# EAGLE design SCHEMA (EAGLE 6.3)
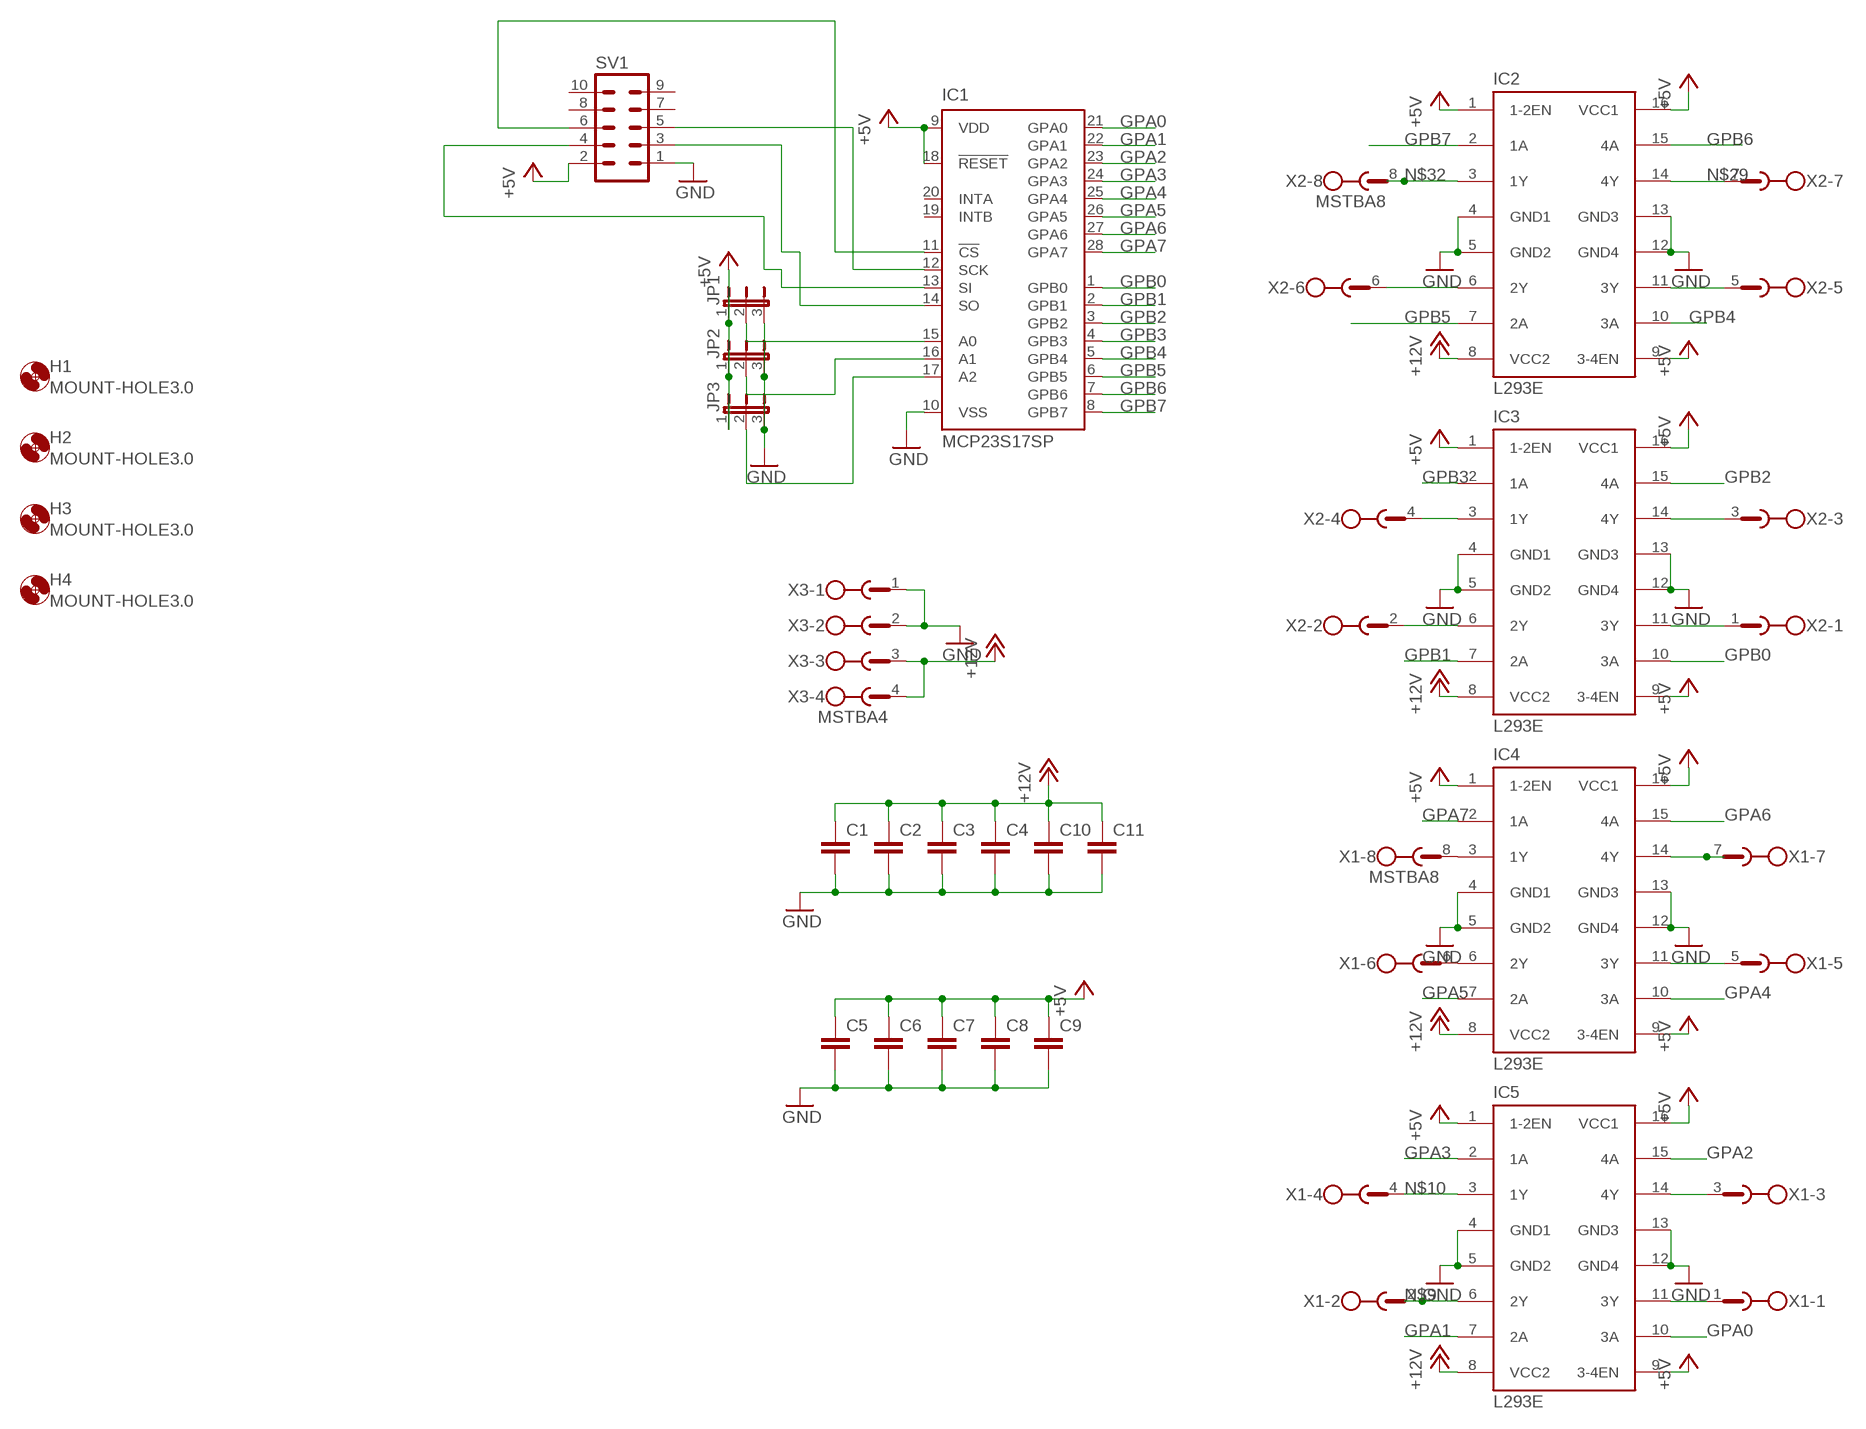
[diagram p0: schematic, sheet 1]

## Parts
C1  C-EU025-025X050  [C025-025X050]
C2  C-EU025-025X050  [C025-025X050]
C3  C-EU025-025X050  [C025-025X050]
C4  C-EU025-025X050  [C025-025X050]
C5  C-EU025-025X050  [C025-025X050]
C6  C-EU025-025X050  [C025-025X050]
C7  C-EU025-025X050  [C025-025X050]
C8  C-EU025-025X050  [C025-025X050]
C9  C-EU025-025X050  [C025-025X050]
C10  C-EU025-025X050  [C025-025X050]
C11  C-EU025-025X050  [C025-025X050]
H1  MOUNT-HOLE3.0  [3,0]
H2  MOUNT-HOLE3.0  [3,0]
H3  MOUNT-HOLE3.0  [3,0]
H4  MOUNT-HOLE3.0  [3,0]
IC1  MCP23S17SP  [DIL28-3]
IC2  L293E  [DIL16]
IC3  L293E  [DIL16]
IC4  L293E  [DIL16]
IC5  L293E  [DIL16]
JP1  JP2E  [JP2]
JP2  JP2E  [JP2]
JP3  JP2E  [JP2]
SV1  ML10  [ML10]
X1  MSTBA8  [MSTBA8]
X2  MSTBA8  [MSTBA8]
X3  MSTBA4  [MSTBA4]

## Nets
+5V: C5.1 C6.1 C7.1 C8.1 C9.1 IC1.9(VDD) IC1.18(!RESET) IC2.1(1-2EN) IC2.9(3-4EN) IC2.16(VCC1) IC3.1(1-2EN) IC3.9(3-4EN) IC3.16(VCC1) IC4.1(1-2EN) IC4.9(3-4EN) IC4.16(VCC1) IC5.1(1-2EN) IC5.9(3-4EN) IC5.16(VCC1) JP1.1 JP2.1 JP3.1 SV1.2
+12V: C1.1 C2.1 C3.1 C4.1 C10.1 C11.1 IC2.8(VCC2) IC3.8(VCC2) IC4.8(VCC2) IC5.8(VCC2) X3.3 X3.4
GND: C1.2 C2.2 C3.2 C4.2 C5.2 C6.2 C7.2 C8.2 C9.2 C10.2 C11.2 IC1.10(VSS) IC2.4(GND1) IC2.5(GND2) IC2.12(GND4) IC2.13(GND3) IC3.4(GND1) IC3.5(GND2) IC3.12(GND4) IC3.13(GND3) IC4.4(GND1) IC4.5(GND2) IC4.12(GND4) IC4.13(GND3) IC5.4(GND1) IC5.5(GND2) IC5.12(GND4) IC5.13(GND3) JP1.3 JP2.3 JP3.3 SV1.1 X3.1 X3.2
GPA0: IC1.21(GPA0) IC5.10(3A)
GPA1: IC1.22(GPA1) IC5.7(2A)
GPA2: IC1.23(GPA2) IC5.15(4A)
GPA3: IC1.24(GPA3) IC5.2(1A)
GPA4: IC1.25(GPA4) IC4.10(3A)
GPA5: IC1.26(GPA5) IC4.7(2A)
GPA6: IC1.27(GPA6) IC4.15(4A)
GPA7: IC1.28(GPA7) IC4.2(1A)
GPB0: IC1.1(GPB0) IC3.10(3A)
GPB1: IC1.2(GPB1) IC3.7(2A)
GPB2: IC1.3(GPB2) IC3.15(4A)
GPB3: IC1.4(GPB3) IC3.2(1A)
GPB4: IC1.5(GPB4) IC2.10(3A)
GPB5: IC1.6(GPB5) IC2.7(2A)
GPB6: IC1.7(GPB6) IC2.15(4A)
GPB7: IC1.8(GPB7) IC2.2(1A)
N$1: IC4.6(2Y) X1.6
N$2: IC4.3(1Y) X1.8
N$3: IC1.14(SO) SV1.3
N$4: IC1.15(A0) JP1.2
N$5: IC1.16(A1) JP2.2
N$6: IC1.17(A2) JP3.2
N$7: IC1.13(SI) SV1.4
N$8: IC1.12(SCK) SV1.5
N$9: IC5.6(2Y) X1.2
N$10: IC5.3(1Y) X1.4
N$11: IC1.11(!CS) SV1.6
N$12: IC5.14(4Y) X1.3
N$13: IC5.11(3Y) X1.1
N$16: IC4.14(4Y) X1.7
N$17: IC4.11(3Y) X1.5
N$22: IC3.14(4Y) X2.3
N$23: IC3.11(3Y) X2.1
N$26: IC3.3(1Y) X2.4
N$27: IC3.6(2Y) X2.2
N$29: IC2.14(4Y) X2.7
N$30: IC2.11(3Y) X2.5
N$31: IC2.6(2Y) X2.6
N$32: IC2.3(1Y) X2.8
Unconnected: IC1.19(INTB) IC1.20(INTA) SV1.7 SV1.8 SV1.9 SV1.10

## Library data of the parts
C1-C11 = rcl:C-EU: CAPACITOR, European symbol
H1-H4 = holes:MOUNT-HOLE: MOUNTING HOLE with drill center marker
IC1 = microchip:MCP23S17: http://ww1.microchip.com/downloads/en/DeviceDoc/21952a.pdf Source: http://ww1.microchip.com/downloads/en/DeviceDoc/21952a.pdf; MF: MICROCHIP; MPN: MCP23S17-E/SP; OC_FARNELL: 1292238; OC_NEWARK: 31K2951
IC2-IC5 = texas:L293E: TI DEVICE; MF: Arrow Electronics; MPN: L293E; OC_FARNELL: 1467711; OC_NEWARK: 89K0732
JP1-JP3 = jumper:JP2E: JUMPER
SV1 = con-harting-ml:ML10: HARTING; OC_FARNELL: unknown; OC_NEWARK: unknown
X1 X2 = con-phoenix-508:MSTBA8: PHOENIX; MF: FARNELL; MPN: 1757307; OC_FARNELL: 3705225; OC_NEWARK: 71C4166
X3 = con-phoenix-508:MSTBA4: PHOENIX; MF: FARNELL; MPN: 1757268; OC_FARNELL: 3705195; OC_NEWARK: 71C4163

## Board
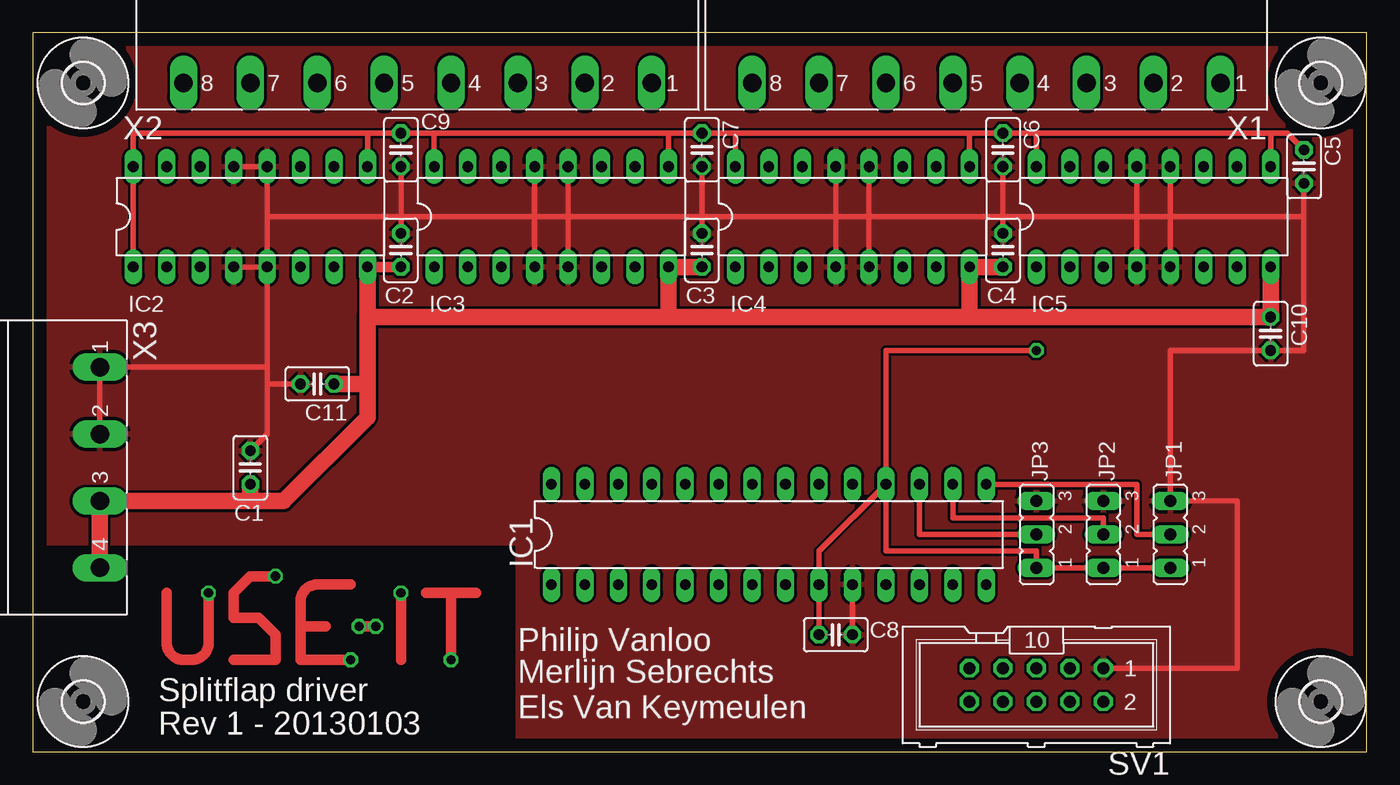
[diagram p1: board, top side]
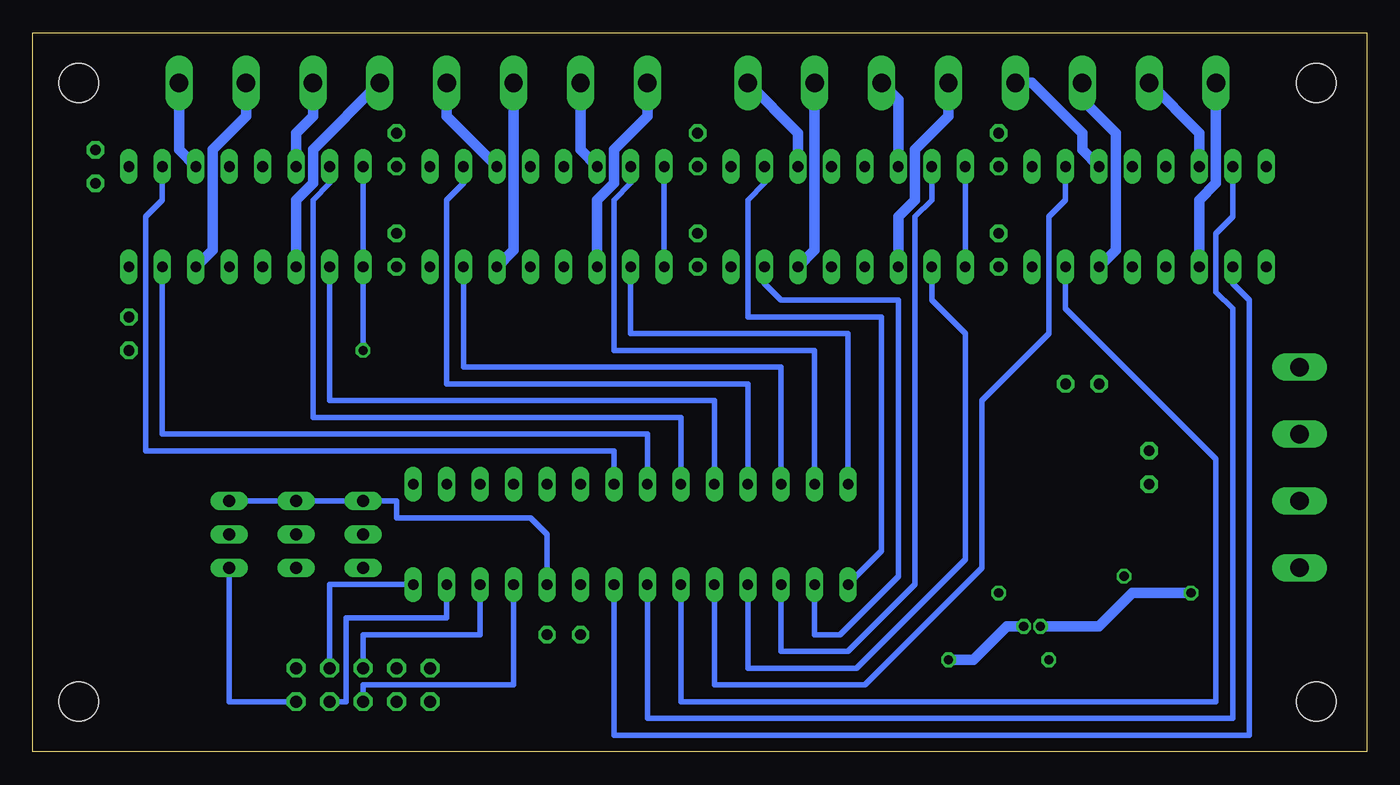
[diagram p2: board, bottom side, seen from below]

Size 101.27 x 54.6 mm. Coordinates in mm from the lower left corner, seen from the top.
Outline: 0,0 101.27,0 101.27,54.6 0,54.6 0,0
Copper layers (1*16): Top 0.035mm / dielectric 1.5mm / Bottom 0.035mm
Design rules "default": minimum track width 10mil, minimum drill 24mil, track to track 8mil, track to pad 8mil, pad to pad 8mil, via to via 8mil, smd to smd 8mil, copper to edge 40mil, drill to drill 8mil, minimum pad ring 10mil, minimum via ring 8mil, stop-mask expansion 4mil, vias tented up to drill 0mil, thermal gap 10mil

### Footprints (pad centres in the part's own frame; a part is rotated, then mirrored left to right if it is on the bottom)
C025-025X050 = drill 0.813 octagon: 1 -1.27,0; 2 1.27,0
3,0 = hole 3: 0,0
DIL28-3 = drill 0.813 long: 1 -16.51,-3.81; 2 -13.97,-3.81; 3 -11.43,-3.81; 4 -8.89,-3.81; 5 -6.35,-3.81; 6 -3.81,-3.81; 7 -1.27,-3.81; 8 1.27,-3.81; 9 3.81,-3.81; 10 6.35,-3.81; 11 8.89,-3.81; 12 11.43,-3.81; 13 13.97,-3.81; 14 16.51,-3.81; 15 16.51,3.81; 16 13.97,3.81; 17 11.43,3.81; 18 8.89,3.81; 19 6.35,3.81; 20 3.81,3.81; 21 1.27,3.81; 22 -1.27,3.81; 23 -3.81,3.81; 24 -6.35,3.81; 25 -8.89,3.81; 26 -11.43,3.81; 27 -13.97,3.81; 28 -16.51,3.81
DIL16 = drill 0.813 long: 1 -8.89,-3.81; 2 -6.35,-3.81; 3 -3.81,-3.81; 4 -1.27,-3.81; 5 1.27,-3.81; 6 3.81,-3.81; 7 6.35,-3.81; 8 8.89,-3.81; 9 8.89,3.81; 10 6.35,3.81; 11 3.81,3.81; 12 1.27,3.81; 13 -1.27,3.81; 14 -3.81,3.81; 15 -6.35,3.81; 16 -8.89,3.81
JP2 = drill 0.914 long: 1 -2.54,0; 2 0,0; 3 2.54,0
ML10 = drill 0.914 octagon: 1 -5.08,-1.27; 2 -5.08,1.27; 3 -2.54,-1.27; 4 -2.54,1.27; 5 0,-1.27; 6 0,1.27; 7 2.54,-1.27; 8 2.54,1.27; 9 5.08,-1.27; 10 5.08,1.27
MSTBA8 = drill 1.397 long: 1 -17.78,5.08; 2 -12.7,5.08; 3 -7.62,5.08; 4 -2.54,5.08; 5 2.54,5.08; 6 7.62,5.08; 7 12.7,5.08; 8 17.78,5.08
MSTBA4 = drill 1.397 long: 1 -7.62,5.08; 2 -2.54,5.08; 3 2.54,5.08; 4 7.62,5.08

### Placement (x,y rotation side)
C1  16.51,21.59 90 top
C2  27.94,38.1 90 top
C3  50.8,38.1 90 top
C4  73.66,38.1 90 top
C5  96.52,44.45 270 top
C6  73.66,45.72 270 top
C7  50.8,45.72 270 top
C8  60.96,8.89 0 top
C9  27.94,45.72 270 top
C10  93.98,31.75 270 top
C11  21.59,27.94 180 top
H1  97.79,50.8 0 top
H2  97.79,3.81 0 top
H3  3.81,3.81 0 top
H4  3.81,50.8 0 top
IC1  55.88,16.51 0 top
IC2  16.51,40.64 0 top
IC3  39.37,40.64 0 top
IC4  62.23,40.64 0 top
IC5  85.09,40.64 0 top
JP1  86.36,16.51 90 top
JP2  81.28,16.51 90 top
JP3  76.2,16.51 90 top
SV1  76.2,5.08 180 top
X1  72.39,55.88 180 top
X2  29.21,55.88 180 top
X3  0,21.59 270 top

### Tracks (layer width: path | path; a pad name or v marks a point on that pad's centre or on a via)
+5V  (via drill 0.7)
  Top 0.406: 25.4,46.99 7.62,46.99 IC2.16 IC2.1 | 25.4,46.99 C9.1 30.48,46.99 | 30.48,46.99 48.26,46.99 | 48.26,46.99 C7.1 53.34,46.99 | 53.34,46.99 71.12,46.99 | 71.12,46.99 C6.1 76.2,46.99 | 76.2,46.99 IC5.16 | IC4.16 53.34,46.99 | IC3.16 30.48,46.99 | IC2.9 25.4,46.99 | IC3.9 48.26,46.99 | IC4.9 71.12,46.99 | IC5.9 93.98,46.99 | 93.98,46.99 76.2,46.99 | v76.2,30.48 64.77,30.48 IC1.18 | IC1.18 59.69,15.24 IC1.9 C8.1 | IC1.18 64.77,15.24 76.2,15.24 JP3.1 JP2.1 JP1.1 | C5.1 95.25,46.99 93.98,46.99
  Bottom 0.406: IC3.16 IC3.1 | IC4.16 IC4.1 | IC5.16 IC5.1 v76.2,30.48 | JP1.1 86.36,3.81 SV1.2
+12V
  Top 0.406: 16.51,19.05 19.05,19.05
  Top 0.813: IC2.8 C2.1
  Top 1.27: IC2.8 25.4,33.02 | 25.4,33.02 48.26,33.02 | 48.26,33.02 71.12,33.02 | 71.12,33.02 C10.1 IC5.8 | 71.12,33.02 IC4.8 C4.1 | 48.26,33.02 IC3.8 C3.1 | X3.4 X3.3 19.05,19.05 25.4,25.4 25.4,27.94 | 25.4,27.94 25.4,33.02 | C1.1 16.51,19.05 | C11.1 25.4,27.94
GND
  Top 0.406: IC2.5 IC2.4 | IC2.13 IC2.12 17.78,40.64 | 17.78,40.64 IC2.5 | 17.78,40.64 27.94,40.64 | 27.94,40.64 38.1,40.64 | 38.1,40.64 40.64,40.64 | 40.64,40.64 50.8,40.64 | 50.8,40.64 60.96,40.64 | 60.96,40.64 63.5,40.64 | 63.5,40.64 73.66,40.64 | 73.66,40.64 83.82,40.64 | 83.82,40.64 86.36,40.64 | 86.36,40.64 IC5.12 | IC4.13 60.96,40.64 | IC4.12 63.5,40.64 | IC4.5 63.5,40.64 | IC4.4 60.96,40.64 | IC5.5 86.36,40.64 | IC5.13 83.82,40.64 | IC5.4 83.82,40.64 | IC3.4 38.1,40.64 | IC3.5 40.64,40.64 | IC3.12 40.64,40.64 | IC3.13 38.1,40.64 | 96.52,40.64 96.52,30.48 86.36,30.48 JP1.3 91.44,19.05 91.44,6.35 SV1.1 | 96.52,40.64 86.36,40.64 | X3.2 X3.1 17.78,29.21 | 17.78,27.94 17.78,29.21 | 17.78,29.21 IC2.5 | C9.2 27.94,40.64 | 27.94,40.64 C2.2 | C7.2 50.8,40.64 | 50.8,40.64 C3.2 | C6.2 73.66,40.64 | C4.2 73.66,40.64 | C5.2 96.52,40.64 | C1.2 17.78,24.13 17.78,27.94 | C8.2 IC1.10 | C11.2 17.78,27.94
  Bottom 0.406: IC1.10 62.23,16.51 63.5,17.78 73.66,17.78 73.66,19.05 JP3.3 JP2.3 JP1.3
  pour Top: -1.27,55.88 101.6,55.88 102.87,54.61 102.87,0 36.83,0 36.83,15.88 -1.27,15.88
GPA0
  Bottom 0.406: IC1.21 57.15,22.86 92.71,22.86 92.71,40.64 91.44,41.91 IC5.10
GPA1
  Bottom 0.406: IC1.22 54.61,24.13 91.44,24.13 IC5.7
GPA2
  Bottom 0.406: IC1.23 52.07,25.4 80.01,25.4 80.01,41.91 78.74,43.18 IC5.15
GPA3
  Bottom 0.406: IC1.24 49.53,26.67 78.74,26.67 IC5.2
GPA4
  Bottom 0.406: IC4.10 68.58,43.18 69.85,41.91 69.85,27.94 46.99,27.94 IC1.25
GPA5
  Bottom 0.406: IC1.26 44.45,29.21 68.58,29.21 IC4.7
GPA6
  Bottom 0.406: IC1.27 41.91,30.48 57.15,30.48 57.15,41.91 55.88,43.18 IC4.15
GPA7
  Bottom 0.406: IC1.28 39.37,31.75 55.88,31.75 IC4.2
GPB0
  Bottom 0.406: IC1.1 36.83,15.24 36.83,33.02 46.99,33.02 46.99,41.91 45.72,43.18 IC3.10
GPB1
  Bottom 0.406: IC1.2 41.91,8.89 40.01,8.89 35.56,13.34 35.56,34.29 44.45,34.29 45.72,35.56 IC3.7
GPB2
  Bottom 0.406: IC1.3 44.45,7.62 39.37,7.62 34.29,12.7 34.29,40.64 33.02,41.91 IC3.15
GPB3
  Bottom 0.406: IC1.4 46.99,6.35 38.73,6.35 30.48,14.61 30.48,31.75 33.02,34.29 IC3.2
GPB4
  Bottom 0.406: IC1.5 49.53,5.08 38.1,5.08 29.21,13.97 29.21,26.67 24.13,31.75 24.13,40.64 22.86,41.91 IC2.10
GPB5
  Bottom 0.406: IC1.6 52.07,3.81 11.43,3.81 11.43,22.23 22.86,33.66 IC2.7
GPB6
  Bottom 0.406: IC1.7 54.61,2.54 10.16,2.54 10.16,33.66 11.43,34.92 11.43,39.37 10.16,40.64 IC2.15
GPB7
  Bottom 0.406: IC1.8 57.15,1.27 8.89,1.27 8.89,34.29 10.16,35.56 IC2.2
N$1
  Bottom 0.813: IC4.6 64.77,38.1 X1.6
N$2
  Bottom 0.813: IC4.3 58.42,41.91 57.15,43.18 57.15,45.72 54.61,48.26 X1.8
N$3
  Bottom 0.406: IC1.14 78.74,12.7 SV1.3
N$4
  Top 0.406: IC1.15 83.82,20.32 83.82,16.51 JP1.2
N$5
  Top 0.406: IC1.16 69.85,17.78 81.28,17.78 JP2.2
N$6
  Top 0.406: IC1.17 67.31,16.51 JP3.2
N$7
  Bottom 0.406: IC1.13 69.85,10.16 77.47,10.16 77.47,3.81 SV1.4
N$8
  Bottom 0.406: IC1.12 67.31,8.89 76.2,8.89 SV1.5
N$9
  Bottom 0.813: IC5.6 87.63,38.1 87.63,45.72 85.09,48.26 X1.2
N$10
  Bottom 0.813: IC5.3 81.28,41.91 80.01,43.18 80.01,45.72 X1.4
N$11
  Bottom 0.406: IC1.11 64.77,5.08 76.2,5.08 SV1.6
N$12
  Bottom 0.813: IC5.14 81.28,46.99 80.01,48.26 X1.3
N$13
  Bottom 0.813: IC5.11 90.17,45.72 X1.1
N$15  (via drill 0.7)
  Top 0.813: 15.24,6.99 18.41,6.99 18.41,8.89 17.14,10.16 15.24,10.16 15.24,12.06 16.51,13.34 v18.41,13.34
N$16
  Bottom 0.813: IC4.14 59.69,45.72 X1.7
N$17
  Bottom 0.813: IC4.11 69.85,48.26 X1.5
N$18  (via drill 0.7)
  Top 0.813: 20.32,9.53 20.32,6.99 v24.13,6.99 | 20.32,9.53 20.32,11.43 arc-90 21.59,12.7 24.13,12.7 | 20.32,9.53 22.23,9.53
N$19  (via drill 0.7)
  Top 0.813: 27.94,6.99 v27.94,12.06
N$20  (via drill 0.7)
  Top 0.813: 29.84,12.06 31.75,12.06 | 33.66,12.06 31.75,12.06 | 31.75,12.06 v31.75,6.99 | v24.77,9.53 v26.04,9.53 | 10.16,12.06 10.16,8.26 arc90 11.43,6.99 12.06,6.99 arc90 13.34,8.26 v13.34,12.06
  Bottom 0.813: v31.75,6.99 29.84,6.99 27.3,9.53 v26.04,9.53 | v24.77,9.53 20.32,9.53 17.78,12.06 v13.34,12.06
N$22
  Bottom 0.813: X2.3 35.56,49.53 IC3.14
N$23
  Bottom 0.813: IC3.11 43.18,46.99 X2.1
N$26
  Bottom 0.813: IC3.3 35.56,40.64 34.29,41.91 34.29,45.72 31.75,48.26 X2.4
N$27
  Bottom 0.813: IC3.6 41.91,38.1 X2.2
N$29
  Bottom 0.813: IC2.14 12.7,46.99 X2.7
N$30
  Bottom 0.813: IC2.11 21.59,45.72 21.59,46.99 25.4,50.8 X2.5
N$31
  Bottom 0.813: IC2.6 19.05,38.1 19.05,46.99 21.59,49.53 X2.6
N$32
  Bottom 0.813: IC2.3 12.7,41.91 11.43,43.18 X2.8

### Text on the board
tNames: Philip Vanloo | Splitflap driver | Merlijn Sebrechts / Els Van Keymeulen | Rev 1 - 20130103